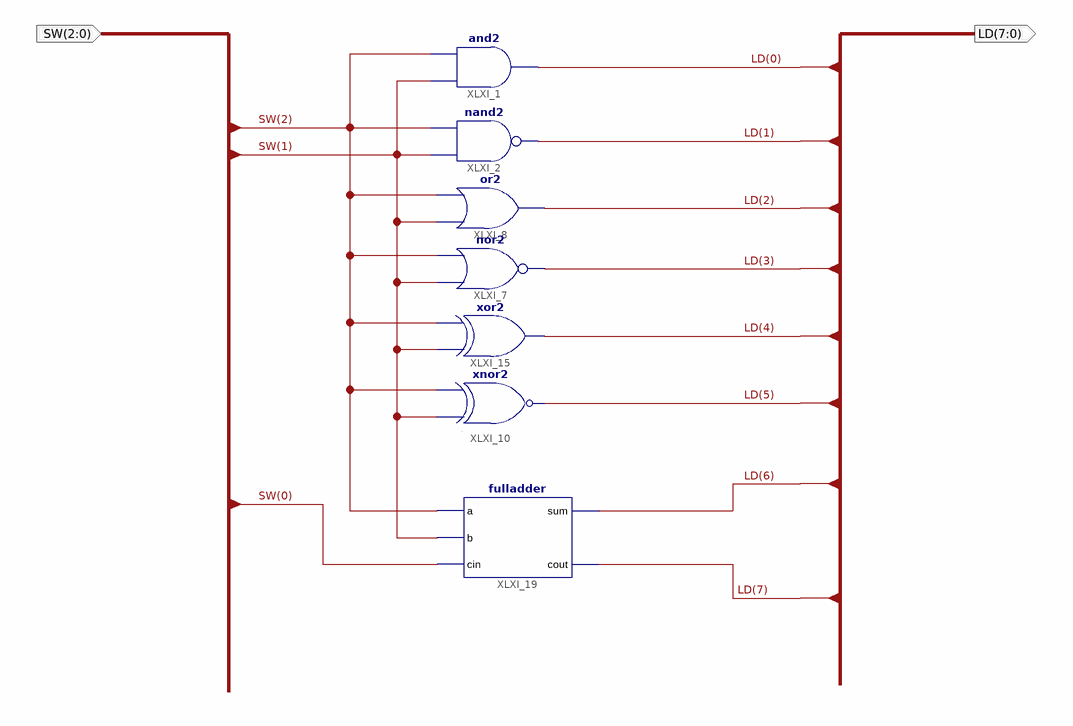
[diagram p0: schematic sheet 1]
// Xilinx ISE schematic gate2.sch (spartan3e) as structural Verilog: 7 symbols, 2 ports
module gate2 (
  input  [2:0] SW,
  output [7:0] LD
);

  and XLXI_1 (LD[0], SW[1], SW[2]);
  nand XLXI_2 (LD[1], SW[1], SW[2]);
  nor XLXI_7 (LD[3], SW[1], SW[2]);
  or XLXI_8 (LD[2], SW[1], SW[2]);
  xnor XLXI_10 (LD[5], SW[1], SW[2]);
  xor XLXI_15 (LD[4], SW[1], SW[2]);
  fulladder XLXI_19 (.a(SW[2]), .b(SW[1]), .cin(SW[0]), .sum(LD[6]), .cout(LD[7]));
endmodule
